# Altium schematic sheet CC_capteurs.SchDoc
size A3; Author: Audran; CompanyName: Goldorak; Address1: Electrolab; Address2: 52 rue Paul Lescop; Address3: 92000 Nanterre; ProjectName: Cartes_2017
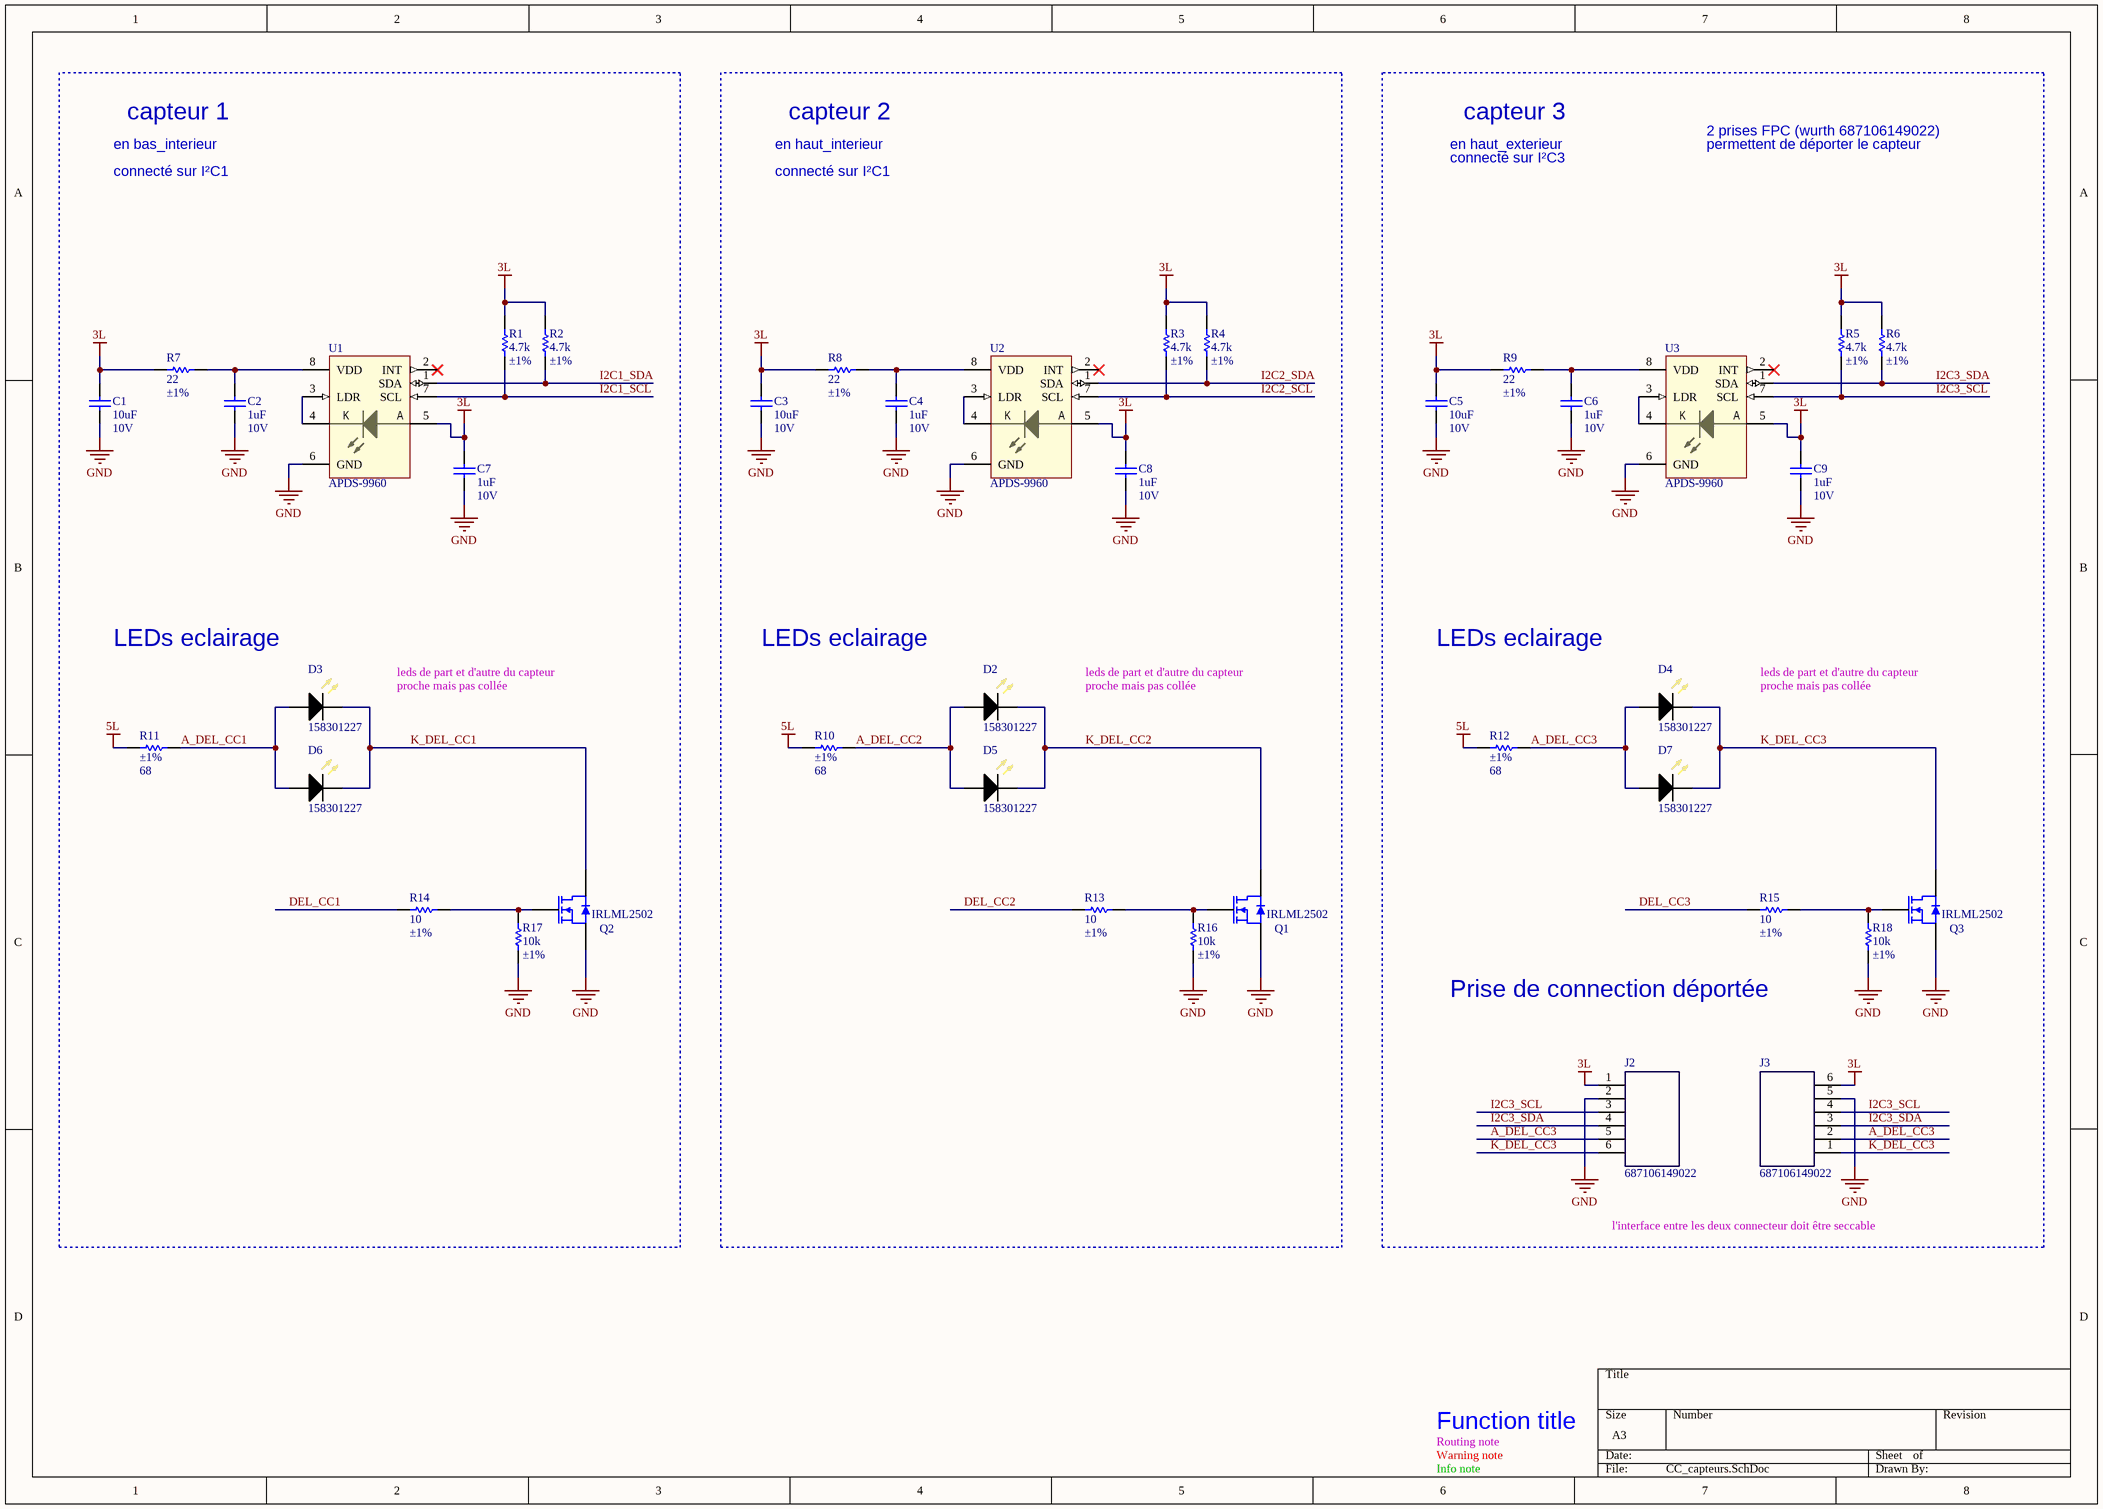
[diagram p0: CC_capteurs.SchDoc]

## Parts
C1  10uF  RatedVoltage: 10V  [WCAP-CSGP_0805, 2x1.25x1.25]
C2  1uF  RatedVoltage: 10V  [WCAP-CSGP_0402, 1x0.5x0.5]
C3  10uF  RatedVoltage: 10V  [WCAP-CSGP_0805, 2x1.25x1.25]
C4  1uF  RatedVoltage: 10V  [WCAP-CSGP_0402, 1x0.5x0.5]
C5  10uF  RatedVoltage: 10V  [WCAP-CSGP_0805, 2x1.25x1.25]
C6  1uF  RatedVoltage: 10V  [WCAP-CSGP_0402, 1x0.5x0.5]
C7  1uF  RatedVoltage: 10V  [WCAP-CSGP_0402, 1x0.5x0.5]
C8  1uF  RatedVoltage: 10V  [WCAP-CSGP_0402, 1x0.5x0.5]
C9  1uF  RatedVoltage: 10V  [WCAP-CSGP_0402, 1x0.5x0.5]
D2  158301227  [WL-SWTP_3014]
D3  158301227  [WL-SWTP_3014]
D4  158301227  [WL-SWTP_3014]
D5  158301227  [WL-SWTP_3014]
D6  158301227  [WL-SWTP_3014]
D7  158301227  [WL-SWTP_3014]
J2  687106149022  [687106149022]
J3  687106149022  [687106149022]
Q1  IRLML2502  [SOT-23]
Q2  IRLML2502  [SOT-23]
Q3  IRLML2502  [SOT-23]
R1  value 4.7k  Precision: ±1%  [RESC1005X04N]
R2  value 4.7k  Precision: ±1%  [RESC1005X04N]
R3  value 4.7k  Precision: ±1%  [RESC1005X04N]
R4  value 4.7k  Precision: ±1%  [RESC1005X04N]
R5  value 4.7k  Precision: ±1%  [RESC1005X04N]
R6  value 4.7k  Precision: ±1%  [RESC1005X04N]
R7  value 22  Precision: ±1%  [RESC1005X04N]
R8  value 22  Precision: ±1%  [RESC1005X04N]
R9  value 22  Precision: ±1%  [RESC1005X04N]
R10  value 68  Precision: ±1%  [RESC1608X06N]  (hidden comment: RC0603FR-0768RL)
R11  value 68  Precision: ±1%  [RESC1608X06N]  (hidden comment: RC0603FR-0768RL)
R12  value 68  Precision: ±1%  [RESC1608X06N]  (hidden comment: RC0603FR-0768RL)
R13  value 10  Precision: ±1%  [RESC1005X04N]  (hidden comment: RC0402FR-0710RL)
R14  value 10  Precision: ±1%  [RESC1005X04N]  (hidden comment: RC0402FR-0710RL)
R15  value 10  Precision: ±1%  [RESC1005X04N]  (hidden comment: RC0402FR-0710RL)
R16  value 10k  Precision: ±1%  [RESC1005X04N]  (hidden comment: RC0402FR-0710KL)
R17  value 10k  Precision: ±1%  [RESC1005X04N]  (hidden comment: RC0402FR-0710KL)
R18  value 10k  Precision: ±1%  [RESC1005X04N]  (hidden comment: RC0402FR-0710KL)
U1  APDS-9960  [APDS996X]
U2  APDS-9960  [APDS996X]
U3  APDS-9960  [APDS996X]

## Nets
3L: C1.2 C3.2 C5.2 C7.2 C8.2 C9.2 J2.1 J3.6 R1.1 R2.1 R3.1 R4.1 R5.1 R6.1 R7.1 R8.1 R9.1 U1.5(LED_A) U2.5(LED_A) U3.5(LED_A)
5L: R10.1 R11.1 R12.1
GND: C1.1 C2.1 C3.1 C4.1 C5.1 C6.1 C7.1 C8.1 C9.1 J2.2 J3.5 Q1.2(S) Q2.2(S) Q3.2(S) R16.1 R17.1 R18.1 U1.6(GND) U2.6(GND) U3.6(GND)
A_DEL_CC1: D3.2(A) D6.2(A) R11.2
A_DEL_CC2: D2.2(A) D5.2(A) R10.2
A_DEL_CC3: D4.2(A) D7.2(A) J2.5 J3.2 R12.2
DEL_CC1: R14.1
DEL_CC2: R13.1
DEL_CC3: R15.1
I2C1_SCL: R1.2 U1.7(SCL)
I2C1_SDA: R2.2 U1.1(SDA)
I2C2_SCL: R3.2 U2.7(SCL)
I2C2_SDA: R4.2 U2.1(SDA)
I2C3_SCL: J2.3 J3.4 R5.2 U3.7(SCL)
I2C3_SDA: J2.4 J3.3 R6.2 U3.1(SDA)
K_DEL_CC1: D3.1(C) D6.1(C) Q2.3(D)
K_DEL_CC2: D2.1(C) D5.1(C) Q1.3(D)
K_DEL_CC3: D4.1(C) D7.1(C) J2.6 J3.1 Q3.3(D)
NetC2_2: C2.2 R7.2 U1.8(VDD)
NetC4_2: C4.2 R8.2 U2.8(VDD)
NetC6_2: C6.2 R9.2 U3.8(VDD)
NetQ1_1: Q1.1(G) R13.2 R16.2
NetQ2_1: Q2.1(G) R14.2 R17.2
NetQ3_1: Q3.1(G) R15.2 R18.2
NetU1_3: U1.3(LDR) U1.4(LED_K)
NetU2_3: U2.3(LDR) U2.4(LED_K)
NetU3_3: U3.3(LDR) U3.4(LED_K)

Not connected (* = marked no-connect by the designer): U1 2(INT)*; U2 2(INT)*; U3 2(INT)*

## Notes on the sheet
- connecté sur I²C1
- en bas_interieur
- capteur 1
- en haut_interieur
- capteur 2
- connecté sur I²C3
- en haut_exterieur
- capteur 3
- 2 prises FPC (wurth 687106149022)
- permettent de déporter le capteur
- LEDs eclairage
- leds de part et d'autre du capteur
- proche mais pas collée
- Prise de connection déportée
- l'interface entre les deux connecteur doit être seccable
- Routing note
- Warning note
- Function title
- Info note
- (in symbol APDS9960) K; A

## Library data of the parts
C1 C3 C5 = WCAP-CSGP, 885012207026: CAP CER 10uF 10V X7R 0805; Manufacturer: Wurth Elektronik; PublishedDate: Aug 2016; ComponentLink1Description: Manufacturer; ComponentLink1URL: http://www.we-online.de; ComponentLink2Description: Datasheet; ComponentLink2URL: http://katalog.we-online.com/pbs/datasheet/885012207026.pdf; Manufacturer Part Number: 885012207026; Value: 10uF; Size: 0805; CeramicType: X7R
C2 C4 C6-C9 = WCAP-CSGP, 885012105012: CAP CER 1UF 10V X5R 0402; Manufacturer: Wurth Elektronik; PublishedDate: Aug 2016; ComponentLink1Description: Manufacturer; ComponentLink1URL: http://www.we-online.de; ComponentLink2Description: Datasheet; ComponentLink2URL: http://katalog.we-online.com/pbs/datasheet/885012105012.pdf; Manufacturer Part Number: 885012105012; Value: 1uF; Size: 0402; CeramicType: X5R
D2-D7 = 158301227: LED WL-SWTP WARM WHT 2700K 1206; Manufacturer: Wurth Electronics Inc.; Supplier 1: Farnell; Supplier Part Number 1: 2470220; Manufacturer Part Number: 158301227; ComponentLink1URL: http://katalog.we-online.de/led/datasheet/158301227.pdf; ComponentLink1Description: Datasheet
J2 J3 = 687106149022: CONN .5MM HORZ BOTTOM SMD 6POS; Manufacturer: Wurth Electronics Inc.; Supplier 1: Farnell; Supplier Part Number 1: 2470697; Manufacturer Part Number: 687106149022; ComponentLink1URL: http://katalog.we-online.de/em/datasheet/6871xx149022.pdf; ComponentLink1Description: Datasheet
Q1-Q3 = IRLML2502: MOSFET CANAL N SOT-23; Manufacturer 1: INTERNATIONAL RECTIFIER; Manufacturer Part Number: IRLML2502PBF; ComponentLink1Description: Datasheet; ComponentLink1URL: http://www.farnell.com/datasheets/1912230.pdf; Supplier 1: Farnell; Supplier Part Number 1: 9102981
R1-R6 = RC0402FR-074K7L: RES SMD 4K7 OHM 1% 1/16W 0402; Manufacturer: Yageo; Power: 63mW; Vmax: 50V; Type: Thick Film; ComponentLink1Description: Manufacturer; ComponentLink1URL: http://www.yageo.com/NewPortal/_en/index.jsp; ComponentLink2Description: Datasheet; ComponentLink2URL: http://www.farnell.com/datasheets/2167052.pdf; Manufacturer Part Number: RC0402FR-074K7L; Supplier 1: Farnell; Supplier Part Number 1: 9239316
R7-R9 = RC0402FR-0722RL: RES SMD 22 OHM 1% 1/16W 0402; Manufacturer: Yageo; Power: 63mW; Vmax: 50V; Type: Thick Film; ComponentLink1Description: Manufacturer; ComponentLink1URL: http://www.yageo.com/NewPortal/_en/index.jsp; ComponentLink2Description: Datasheet; ComponentLink2URL: http://www.farnell.com/datasheets/2167052.pdf; Manufacturer Part Number: RC0402FR-0722RL; Supplier 1: Farnell; Supplier Part Number 1: 9239030
R10-R12 = RC0603FR-0768RL: RES SMD 68 OHM 1% 1/10W 0603; Manufacturer: Yageo; Power: 100mW; Vmax: 50V; Manufacturer Part Number: RC0603FR-0768RL; Type: Thick Film; ComponentLink1Description: Manufacturer; ComponentLink1URL: http://www.yageo.com/NewPortal/_en/index.jsp; ComponentLink2Description: Datasheet; ComponentLink2URL: http://www.farnell.com/datasheets/1868787.pdf; Supplier 1: Farnell; Supplier Part Number 1: 9238344
R13-R15 = RC0402FR-0710RL: RES SMD 10 OHM 1% 1/16W 0402; Manufacturer: Yageo; Power: 63mW; Vmax: 50V; Type: Thick Film; ComponentLink1Description: Manufacturer; ComponentLink1URL: http://www.yageo.com/NewPortal/_en/index.jsp; ComponentLink2Description: Datasheet; ComponentLink2URL: http://www.farnell.com/datasheets/1018594.pdf; Manufacturer Part Number: RC0402FR-0710RL; Supplier 1: Farnell; Supplier Part Number 1: 9238999
R16-R18 = RC0402FR-0710KL: RES SMD 10K OHM 1% 1/16W 0402; Manufacturer: Yageo; Power: 63mW; Vmax: 50V; Type: Thick Film; ComponentLink1Description: Manufacturer; ComponentLink1URL: http://www.yageo.com/NewPortal/_en/index.jsp; ComponentLink2Description: Datasheet; ComponentLink2URL: http://www.farnell.com/datasheets/2167052.pdf; Supplier 1: Farnell; Supplier Part Number 1: 9239359; Manufacturer Part Number: RC0402FR-0710KL
U1-U3 = APDS9960: Digital Proximity, Ambient Light, RGB and Gesture Sensor; Manufacturer: AVAGO TECHNOLOGIES; Manufacturer Part Number: APDS-9960; ComponentLink1URL: http://www.farnell.com/datasheets/1801560.pdf; ComponentLink1Description: Datasheet; Supplier 1: Farnell; Supplier Part Number 1: 2401098